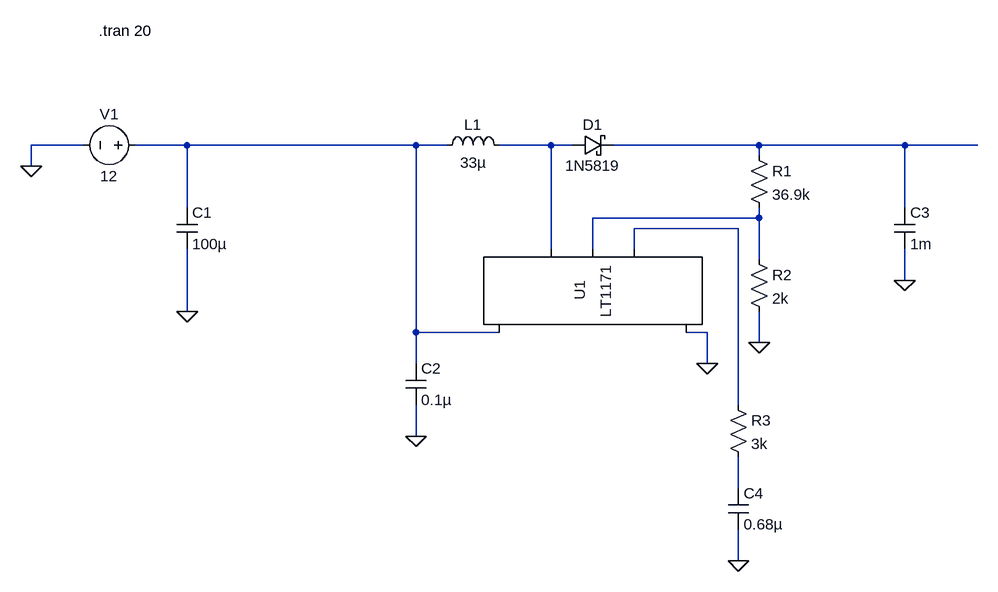
[diagram p0: schematic 12to24boost.asc]
12to24boost.asc, the LTspice schematic file:
Version 4.1
SHEET 1 880 680
WIRE -1072 -192 -1152 -192
WIRE -912 -192 -992 -192
WIRE -560 -192 -912 -192
WIRE -512 -192 -560 -192
WIRE -352 -192 -432 -192
WIRE -320 -192 -352 -192
WIRE -32 -192 -256 -192
WIRE 192 -192 -32 -192
WIRE 304 -192 192 -192
WIRE -32 -176 -32 -192
WIRE -1152 -160 -1152 -192
WIRE -912 -96 -912 -192
WIRE 192 -96 192 -192
WIRE -32 -80 -32 -96
WIRE -32 -80 -288 -80
WIRE -64 -64 -224 -64
WIRE -352 -32 -352 -192
WIRE -288 -32 -288 -80
WIRE -224 -32 -224 -64
WIRE -32 -16 -32 -80
WIRE 192 16 192 -32
WIRE -912 64 -912 -32
WIRE -560 96 -560 -192
WIRE -432 96 -560 96
WIRE -112 96 -144 96
WIRE -32 112 -32 64
WIRE -560 144 -560 96
WIRE -112 144 -112 96
WIRE -64 208 -64 -64
WIRE -560 256 -560 208
WIRE -64 336 -64 288
WIRE -64 448 -64 400
FLAG -912 64 0
FLAG -560 256 0
FLAG 192 16 0
FLAG -32 112 0
FLAG -112 144 0
FLAG -64 448 0
FLAG -1152 -160 0
SYMBOL PowerProducts\\LT1171 -288 96 R270
SYMATTR InstName U1
SYMBOL cap -928 -96 R0
SYMATTR InstName C1
SYMATTR Value 100µ
SYMBOL cap -576 144 R0
SYMATTR InstName C2
SYMATTR Value 0.1µ
SYMBOL ind -528 -176 R270
WINDOW 0 32 56 VTop 2
WINDOW 3 5 56 VBottom 2
SYMATTR InstName L1
SYMATTR Value 33µ
SYMBOL schottky -320 -176 R270
WINDOW 0 32 32 VTop 2
WINDOW 3 0 32 VBottom 2
SYMATTR InstName D1
SYMATTR Value 1N5819
SYMBOL res -48 -32 R0
SYMATTR InstName R2
SYMATTR Value 2k
SYMBOL res -48 -192 R0
SYMATTR InstName R1
SYMATTR Value 36.9k
SYMBOL cap 176 -96 R0
SYMATTR InstName C3
SYMATTR Value 1m
SYMBOL res -80 192 R0
SYMATTR InstName R3
SYMATTR Value 3k
SYMBOL cap -80 336 R0
SYMATTR InstName C4
SYMATTR Value 0.68µ
SYMBOL voltage -976 -192 M270
WINDOW 0 32 56 VTop 2
WINDOW 3 -32 56 VBottom 2
WINDOW 123 0 0 Left 0
WINDOW 39 0 0 Left 0
SYMATTR InstName V1
SYMATTR Value 12
TEXT -1048 -368 Left 2 !.tran 20

The netlist it stands for:
* 12to24boost.asc
X§U1 N005 N004 0 N002 N001 LT1171
C1 N001 0 100µ
C2 N001 0 0.1µ
L1 N001 N002 33µ
D1 N002 N003 1N5819
R2 N004 0 2k
R1 N003 N004 36.9k
C3 N003 0 1m
R3 N005 N006 3k
C4 N006 0 0.68µ
V1 N001 0 12
.model D D
.lib standard.dio
.tran 20
.lib LT1171.sub
.backanno
.end